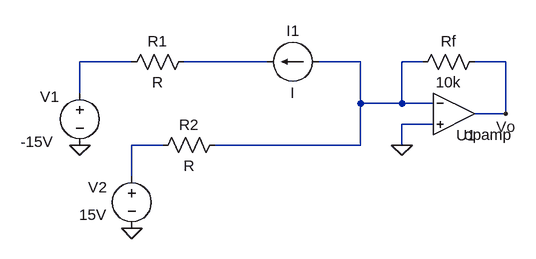
[diagram p0: schematic esercizio2.asc]
esercizio2.asc, the LTspice schematic file:
Version 4
SHEET 1 880 680
WIRE -16 80 -96 80
WIRE 192 80 64 80
WIRE 336 80 272 80
WIRE 432 80 400 80
WIRE 560 80 512 80
WIRE -96 128 -96 80
WIRE 336 144 336 80
WIRE 400 144 400 80
WIRE 400 144 336 144
WIRE 448 144 400 144
WIRE 560 160 560 80
WIRE 560 160 512 160
WIRE 448 176 400 176
WIRE 32 208 -16 208
WIRE 336 208 336 144
WIRE 336 208 112 208
WIRE 400 208 400 176
WIRE -16 256 -16 208
FLAG -96 208 0
FLAG -16 336 0
FLAG 400 208 0
FLAG 560 160 Vo
SYMBOL res 80 64 R90
WINDOW 0 0 56 VBottom 2
WINDOW 3 32 56 VTop 2
SYMATTR InstName R1
SYMBOL res 128 192 R90
WINDOW 0 0 56 VBottom 2
WINDOW 3 32 56 VTop 2
SYMATTR InstName R2
SYMBOL voltage -96 112 R0
WINDOW 0 -61 22 Left 2
WINDOW 3 -91 91 Left 2
WINDOW 123 0 0 Left 0
WINDOW 39 0 0 Left 0
SYMATTR InstName V1
SYMATTR Value -15V
SYMBOL voltage -16 240 R0
WINDOW 0 -67 33 Left 2
WINDOW 3 -81 75 Left 2
SYMATTR InstName V2
SYMATTR Value 15V
SYMBOL current 272 80 R90
WINDOW 0 -32 40 VBottom 2
WINDOW 3 32 40 VTop 2
SYMATTR InstName I1
SYMBOL OpAmps\\opamp 480 96 R0
WINDOW 0 4 97 Left 2
SYMATTR InstName U1
SYMBOL res 528 64 R90
WINDOW 0 0 56 VBottom 2
WINDOW 3 32 56 VTop 2
SYMATTR InstName Rf
SYMATTR Value 10k

The netlist it stands for:
* esercizio2.asc
R1 N002 N001 R
R2 N003 N004 R
V1 N001 0 -15V
V2 N004 0 15V
I1 N003 N002 I
XU1 N003 0 Vo opamp Aol=100K GBW=10Meg  ; pins invin noninvin out
Rf Vo N003 10k
.backanno
.end